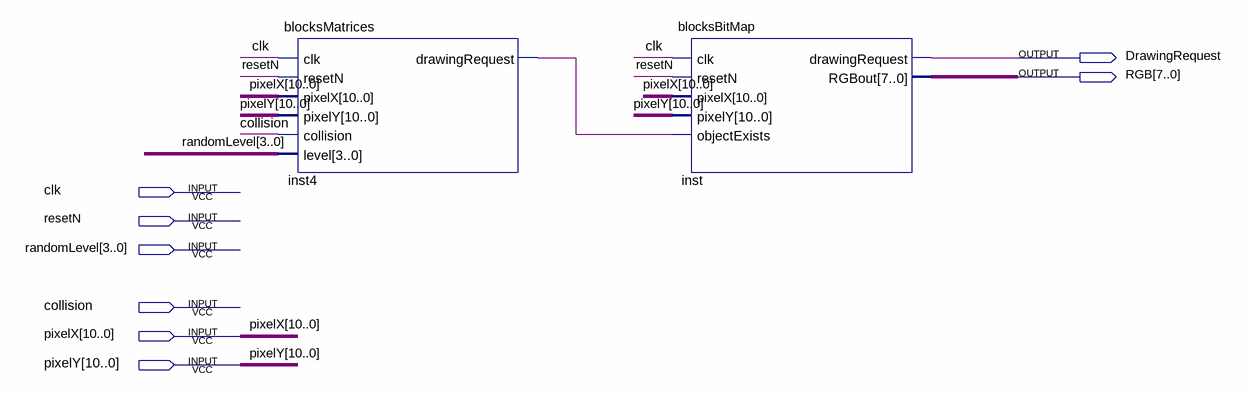
[diagram p0: schematic sheet]
// Quartus schematic blocksTop.bdf as structural Verilog: 2 symbols, 8 pins
module blocksTop (
  input  clk,
  input  resetN,
  input  [3:0] randomLevel,
  input  collision,
  input  [10:0] pixelX,
  input  [10:0] pixelY,
  output DrawingRequest,
  output [7:0] RGB
);

  wire inst4_drawingrequest;

  blocksMatrices inst4 (
    .clk(clk), .resetN(resetN), .pixelX(pixelX), .pixelY(pixelY), .collision(collision), .level(randomLevel),
    .drawingRequest(inst4_drawingrequest));
  blocksBitMap inst (
    .clk(clk), .resetN(resetN), .pixelX(pixelX), .pixelY(pixelY), .objectExists(inst4_drawingrequest),
    .drawingRequest(DrawingRequest), .RGBout(RGB));
endmodule
